# EAGLE design uno_i2c_ntc (EAGLE 7.2.0)
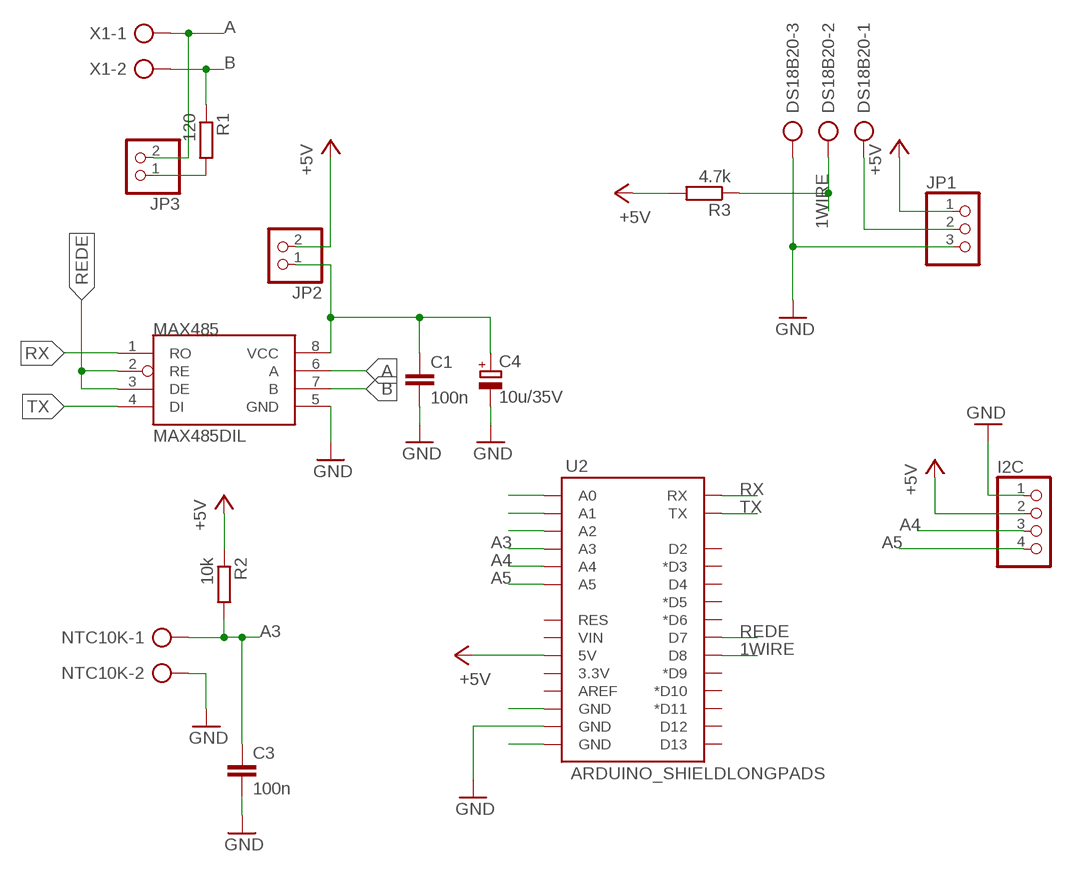
[diagram p0: schematic, sheet 1]

## Parts
C1  100n  C-EU025-024X044  [C025-024X044]
C3  100n  C-EU025-024X044  [C025-024X044]
C4  10u/35V  CPOL-EUE2.5-5  [E2,5-5]
DS18B20  AK500/3  [AK500/3]
I2C  PINHD-1X4/90  [1X04/90]
JP1  PINHD-1X3  [1X03]
JP2  PINHD-1X2  [1X02]
JP3  PINHD-1X2  [1X02]
MAX485  MAX485DIL  [DIL08]
NTC10K  AK500/2  [AK500/2]
R1  120  R-EU_0207/10  [0207/10]
R2  10k  R-EU_0207/10  [0207/10]
R3  4.7k  R-EU_0207/10  [0207/10]
U2  ARDUINO_SHIELDLONGPADS  [DUEMILANOVE_SHIELD_LONGPADS]
X1  AK500/2  [AK500/2]

## Nets
1WIRE: DS18B20.2 R3.1 U2.D8
+5V [Vcc]: I2C.2 JP1.1 JP2.2 R2.1 R3.2 U2.5V
A: JP3.2 MAX485.6(A) X1.1
A0: U2.A0
A1: U2.A1
A2: U2.A2
A3: C3.1 NTC10K.1 R2.2 U2.A3
A4: I2C.3 U2.A4
A5: I2C.4 U2.A5
B: MAX485.7(B) R1.1 X1.2
GND [GND]: C1.2 C3.2 C4.- DS18B20.3 I2C.1 JP1.3 MAX485.5(GND) NTC10K.2 U2.GND@0(GND) U2.GND@1(GND) U2.GND@2(GND)
N$1: JP3.1 R1.2
N$2: DS18B20.1 JP1.2
N$3 [Vcc]: C1.1 C4.+ JP2.1 MAX485.8(VCC)
REDE: MAX485.2(RE) MAX485.3(DE) U2.D7
RX: MAX485.1(RO) U2.RX
TX: MAX485.4(DI) U2.TX
Unconnected: U2.3.3V U2.AREF U2.D2 U2.D3(*D3) U2.D4 U2.D5(*D5) U2.D6(*D6) U2.D9(*D9) U2.D10(*D10) U2.D11(*D11) U2.D12 U2.D13 U2.RES U2.VIN

## Library data of the parts
C1 C3 = rcl:C-EU: CAPACITOR, European symbol
C4 = rcl:CPOL-EU: POLARIZED CAPACITOR, European symbol
DS18B20 = con-ptr500:AK500/3: CONNECTOR; OC_FARNELL: unknown; OC_NEWARK: unknown
I2C = pinhead:PINHD-1X4: PIN HEADER
JP1 = pinhead:PINHD-1X3: PIN HEADER
JP2 JP3 = pinhead:PINHD-1X2: PIN HEADER
MAX485 = SparkFun-DigitalIC:MAX485: RS-485 transceiver
NTC10K X1 = con-ptr500:AK500/2: CONNECTOR; OC_FARNELL: unknown; OC_NEWARK: unknown
R1-R3 = rcl:R-EU_: RESISTOR, European symbol
U2 = SparkFun-Boards:ARDUINO_SHIELD: Arduino shield footprint

## Net classes
0 default: width 0.406 mm, drill 0.6 mm, clearance 0.406 mm
1 GND: width 0.61 mm, drill 0.7 mm, clearance 0.61 mm
2 Vcc: width 0.813 mm, drill 0.7 mm, clearance 0.61 mm

## Board
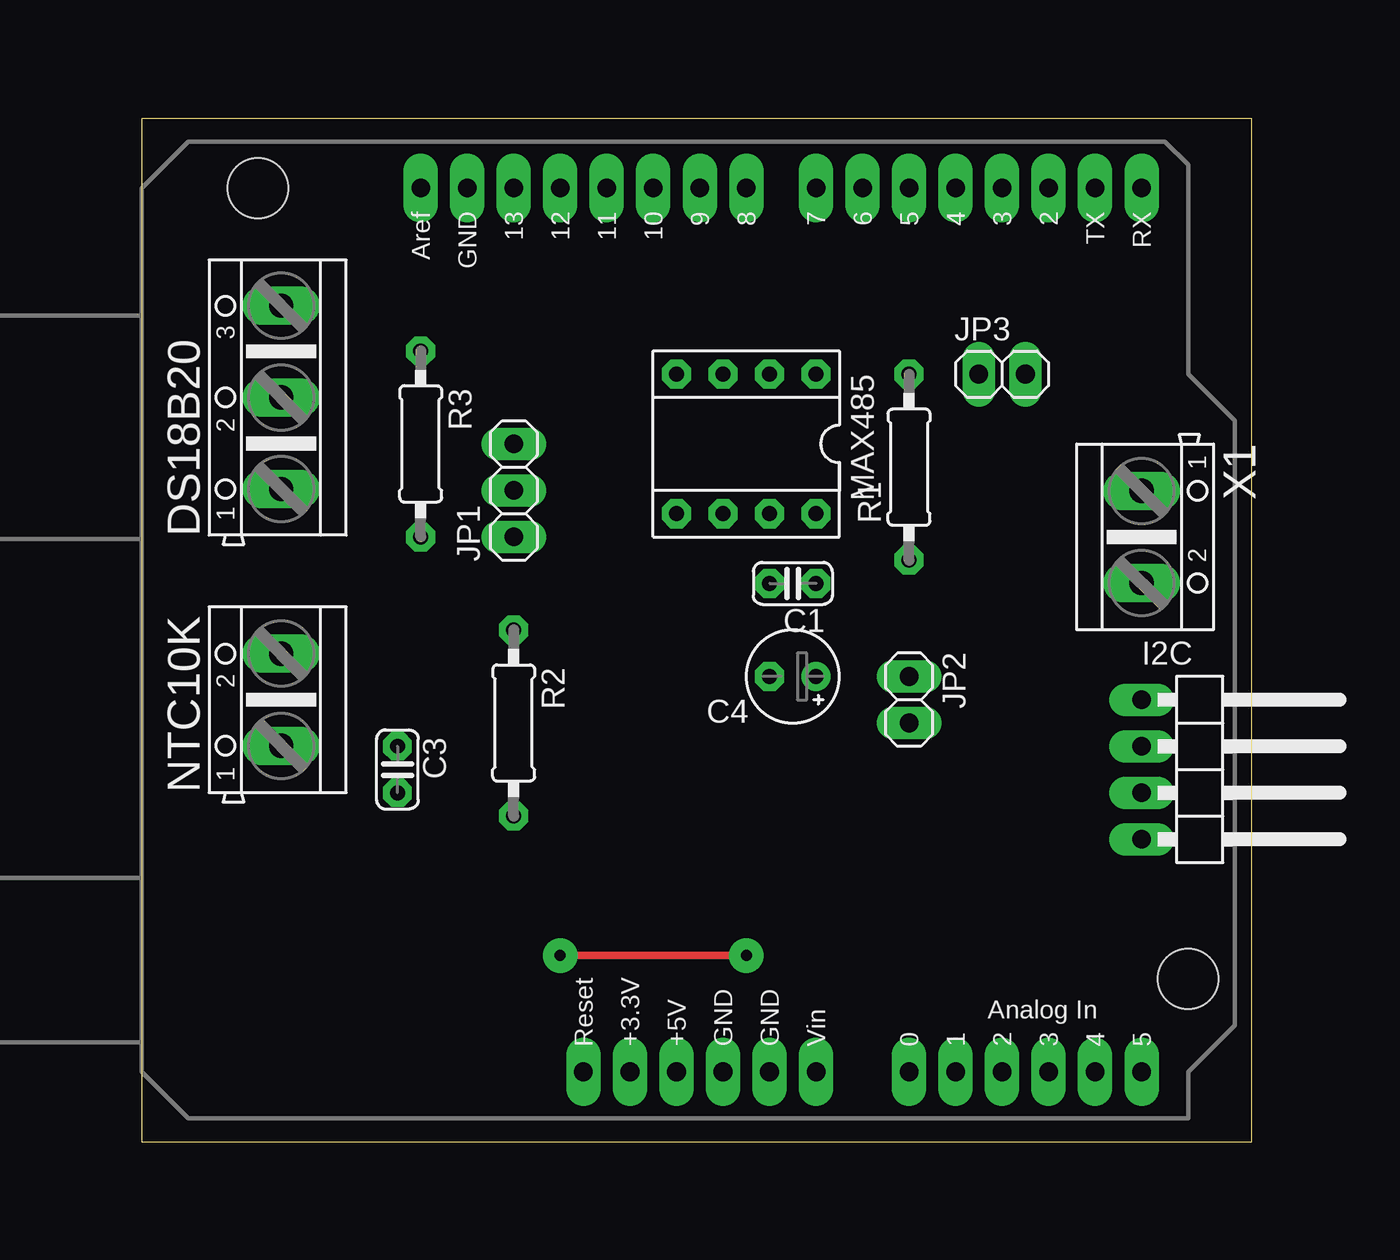
[diagram p1: board, top side]
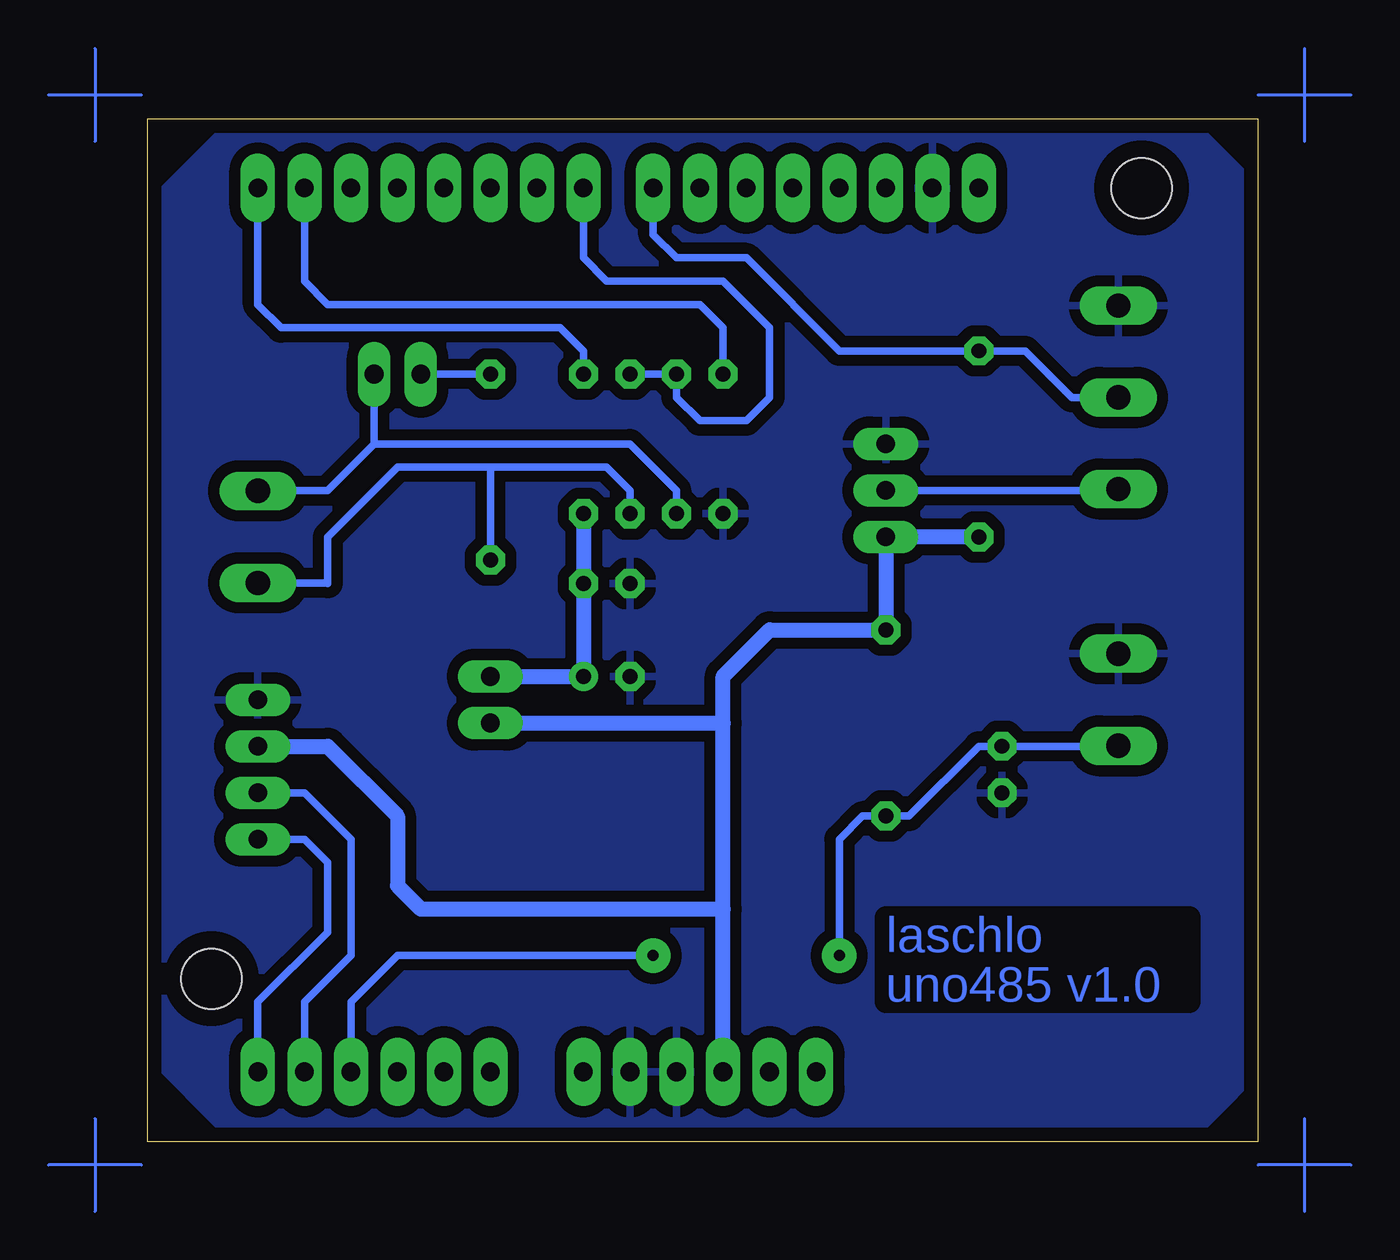
[diagram p2: board, bottom side, seen from below]

Size 60.63 x 55.87 mm. Coordinates in mm from the lower left corner, seen from the top.
Outline: 0,0 60.63,0 60.63,55.87 0,55.87 0,0
Copper layers (1*16): Top 0.035mm / dielectric 1.5mm / Bottom 0.035mm
Design rules "homepcb *": minimum track width 10mil, minimum drill 0.6mm, track to track 16mil, track to pad 10mil, pad to pad 10mil, via to via 10mil, smd to smd 10mil, copper to edge 30mil, drill to drill 10mil, minimum pad ring 15mil, minimum via ring 25mil, stop-mask expansion 0mil, vias tented up to drill 0mil, thermal gap 24mil

### Footprints (pad centres in the part's own frame; a part is rotated, then mirrored left to right if it is on the bottom)
C025-024X044 = drill 0.813 octagon: 1 -1.27,0; 2 1.27,0
E2,5-5 = drill 0.813 pad 1.6: + -1.27,0 | drill 0.813 pad 1.6 octagon: - 1.27,0
AK500/3 = drill 1.321 long: 1 -5.004,0; 2 0,0; 3 5.004,0
1X04/90 = drill 1.016 long: 1 -3.81,-3.81; 2 -1.27,-3.81; 3 1.27,-3.81; 4 3.81,-3.81
1X03 = drill 1.016 long: 1 -2.54,0; 2 0,0; 3 2.54,0
1X02 = drill 1.016 long: 1 -1.27,0; 2 1.27,0
DIL08 = drill 0.813 pad 1.6 octagon: 1 -3.81,-3.81; 2 -1.27,-3.81; 3 1.27,-3.81; 4 3.81,-3.81; 5 3.81,3.81; 6 1.27,3.81; 7 -1.27,3.81; 8 -3.81,3.81
AK500/2 = drill 1.321 long: 1 -2.515,0; 2 2.515,0
0207/10 = drill 0.813 octagon: 1 -5.08,0; 2 5.08,0
DUEMILANOVE_SHIELD_LONGPADS = drill 1.016 pad 1.88 long: 3.3V 50.8,26.67; 5V 50.8,29.21; A0 50.8,41.91; A1 50.8,44.45; A2 50.8,46.99; A3 50.8,49.53; A4 50.8,52.07; A5 50.8,54.61; AREF 2.54,15.24; D2 2.54,49.53; D3 2.54,46.99; D4 2.54,44.45; D5 2.54,41.91; D6 2.54,39.37; D7 2.54,36.83; D8 2.54,33.02; D9 2.54,30.48; D10 2.54,27.94; D11 2.54,25.4; D12 2.54,22.86; D13 2.54,20.32; GND@0 50.8,31.75; GND@1 50.8,34.29; GND@2 2.54,17.78; RES 50.8,24.13; RX 2.54,54.61; TX 2.54,52.07; VIN 50.8,36.83 | hole 3.302: 45.72,57.15; 2.54,6.35

### Placement (x,y rotation side)
C1  35.56,30.48 180 top
C3  13.97,20.32 270 top
C4  35.56,25.4 180 top
DS18B20  7.62,40.64 90 top
I2C  58.42,20.32 270 top
JP1  20.32,35.56 90 top
JP2  41.91,24.13 270 top
JP3  46.99,41.91 0 top
MAX485  33.02,38.1 180 top
NTC10K  7.62,24.13 90 top
R1  41.91,36.83 90 top
R2  20.32,22.86 270 top
R3  15.24,38.1 270 top
U2  0,54.61 270 top
X1  54.61,33.02 270 top

### Tracks (layer width: path | path; a pad name or v marks a point on that pad's centre or on a via)
1WIRE
  Bottom 0.406: DS18B20.2 10.16,40.64 12.7,43.18 R3.1 22.86,43.18 27.94,48.26 31.75,48.26 33.02,49.53 U2.D8 33.02,50.8
+5V
  Bottom 0.813: U2.5V 29.21,12.7 | 29.21,12.7 29.21,22.86 | 29.21,22.86 29.21,25.4 26.67,27.94 R2.1 JP1.1 R3.2 | I2C.2 50.8,21.59 46.99,17.78 46.99,13.97 45.72,12.7 29.21,12.7 | JP2.2 29.21,22.86
A
  Bottom 0.406: X1.1 54.59,35.56 50.8,35.56 48.26,38.1 | 48.26,38.1 34.29,38.1 31.75,35.56 MAX485.6 | JP3.2 48.26,38.1
A3  (via drill 0.6 pad 1.02, 0.6 pad 1.27)
  Top 0.406: v22.86,10.16 v33.02,10.16
  Bottom 0.406: NTC10K.1 7.64,21.59 C3.1 15.24,21.59 19.05,17.78 R2.2 21.59,17.78 22.86,16.51 v22.86,10.16 | v33.02,10.16 46.99,10.16 49.53,7.62 U2.A3
A4
  Bottom 0.406: U2.A4 52.07,7.62 49.53,10.16 49.53,16.51 52.07,19.05 I2C.3
A5
  Bottom 0.406: U2.A5 54.61,7.62 50.8,11.43 50.8,15.24 52.07,16.51 I2C.4
B
  Bottom 0.406: MAX485.7 34.29,35.56 35.56,36.83 41.91,36.83 | 41.91,36.83 46.99,36.83 50.8,33.02 50.8,30.48 50.83,30.5 X1.2 | R1.1 41.91,36.83
GND
  pour Bottom (isolate 0.61): 3.81,55.88 -1.27,50.8 -1.27,5.08 3.81,0 5.08,0 55.88,0 60.96,5.08 60.96,6.35 60.96,50.8 55.88,55.88 54.61,55.88
N$1
  Bottom 0.406: R1.2 JP3.1
N$2
  Bottom 0.406: DS18B20.1 7.7,35.56 JP1.2
N$3
  Bottom 0.813: MAX485.8 C1.1 C4.+ JP2.1
N$4
  Bottom 0.152: -2.54,1.27 -2.54,-3.81
N$5
  Bottom 0.152: -2.54,59.69 -2.54,54.61
N$6
  Bottom 0.152: -5.08,57.15 0,57.15
N$7
  Bottom 0.152: -5.08,-1.27 0,-1.27
N$8
  Bottom 0.152: 63.5,59.69 63.5,54.61
N$9
  Bottom 0.152: 60.96,57.15 66.04,57.15
N$10
  Bottom 0.152: 63.5,1.27 63.5,-3.81
N$11
  Bottom 0.152: 60.96,-1.27 66.04,-1.27
REDE
  Bottom 0.406: MAX485.2 MAX485.3 31.75,40.64 30.48,39.37 27.94,39.37 26.67,40.64 26.67,44.45 29.21,46.99 35.56,46.99 36.83,48.26 U2.D7
RX
  Bottom 0.406: MAX485.1 36.83,43.18 38.1,44.45 53.34,44.45 54.61,45.72 U2.RX
TX
  Bottom 0.406: U2.TX 52.07,46.99 50.8,45.72 30.48,45.72 29.21,44.45 MAX485.4

### Text on the board
Bottom: laschlo / uno485 v1.0